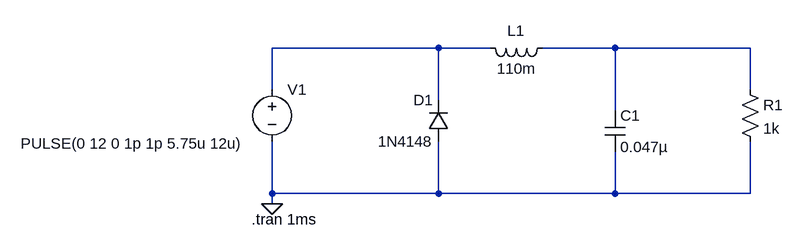
[diagram p0: schematic Simple_Buck.asc]
Simple_Buck.asc, the LTspice schematic file:
Version 4
SHEET 1 880 680
WIRE 288 48 32 48
WIRE 368 48 288 48
WIRE 560 48 448 48
WIRE 768 48 560 48
WIRE 32 112 32 48
WIRE 768 112 768 48
WIRE 288 128 288 48
WIRE 560 144 560 48
WIRE 32 272 32 192
WIRE 288 272 288 192
WIRE 288 272 32 272
WIRE 560 272 560 208
WIRE 560 272 288 272
WIRE 768 272 768 192
WIRE 768 272 560 272
WIRE 32 288 32 272
FLAG 32 288 0
SYMBOL voltage 32 96 R0
WINDOW 3 -387 99 Left 2
WINDOW 123 0 0 Left 0
WINDOW 39 0 0 Left 0
SYMATTR InstName V1
SYMATTR Value PULSE(0 12 0 1p 1p 5.75u 12u)
SYMBOL ind 464 32 R90
WINDOW 0 5 56 VBottom 2
WINDOW 3 32 56 VTop 2
SYMATTR InstName L1
SYMATTR Value 110m
SYMATTR SpiceLine Ipk=0.069 Rser=150 Rpar=0 Cpar=0
SYMBOL diode 304 192 R180
WINDOW 0 24 64 Left 2
WINDOW 3 24 0 Left 2
SYMATTR InstName D1
SYMATTR Value 1N4148
SYMBOL cap 544 144 R0
SYMATTR InstName C1
SYMATTR Value 0.047µ
SYMATTR SpiceLine V=25 Irms=1.3 Rser=0.116668 Lser=0 mfg="KEMET" pn="C1210C473K3RAC" type="X7R"
SYMBOL res 752 96 R0
SYMATTR InstName R1
SYMATTR Value 1k
TEXT 0 312 Left 2 !.tran 1ms

The netlist it stands for:
* Simple_Buck.asc
V1 N001 0 PULSE(0 12 0 1p 1p 5.75u 12u)
L1 N002 N001 110m Ipk=0.069 Rser=150 Rpar=0 Cpar=0
D1 0 N001 1N4148
C1 N002 0 0.047µ V=25 Irms=1.3 Rser=0.116668 Lser=0 mfg="KEMET" pn="C1210C473K3RAC" type="X7R"
R1 N002 0 1k
.model D D
.lib standard.dio
.tran 1ms
.backanno
.end